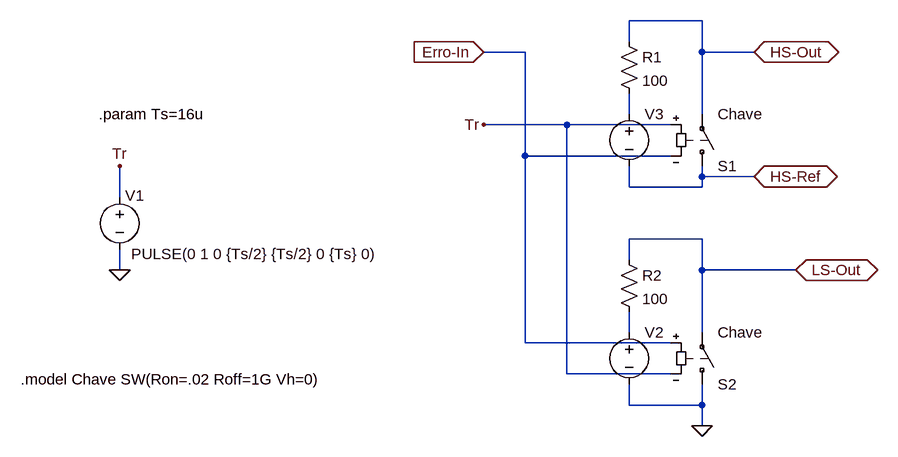
[diagram p0: schematic modulador_PWM_driver.asc]
modulador_PWM_driver.asc, the LTspice schematic file:
Version 4
SHEET 1 1388 680
WIRE 1104 -16 992 -16
WIRE 992 16 992 -16
WIRE 832 32 768 32
WIRE 1104 32 1104 -16
WIRE 1184 32 1104 32
WIRE 992 128 992 96
WIRE 1104 128 1104 32
WIRE 896 144 768 144
WIRE 1056 144 896 144
WIRE 832 192 832 32
WIRE 1056 192 832 192
WIRE 1104 224 1104 208
WIRE 1184 224 1104 224
WIRE 992 240 992 208
WIRE 1104 240 1104 224
WIRE 1104 240 992 240
WIRE 208 256 208 208
WIRE 1104 320 992 320
WIRE 992 352 992 320
WIRE 208 368 208 336
WIRE 1104 368 1104 320
WIRE 1248 368 1104 368
WIRE 992 464 992 432
WIRE 1104 464 1104 368
WIRE 832 480 832 192
WIRE 1056 480 832 480
WIRE 896 528 896 144
WIRE 1056 528 896 528
WIRE 992 576 992 544
WIRE 1104 576 1104 544
WIRE 1104 576 992 576
WIRE 1104 608 1104 576
FLAG 1184 32 HS-Out
IOPIN 1184 32 BiDir
FLAG 1248 368 LS-Out
IOPIN 1248 368 BiDir
FLAG 1184 224 HS-Ref
IOPIN 1184 224 BiDir
FLAG 768 32 Erro-In
IOPIN 768 32 In
FLAG 208 368 0
FLAG 208 208 Tr
FLAG 1104 608 0
FLAG 768 144 Tr
SYMBOL voltage 208 240 R0
WINDOW 3 18 103 Left 2
WINDOW 123 0 0 Left 2
WINDOW 0 9 13 Left 2
SYMATTR Value PULSE(0 1 0 {Ts/2} {Ts/2} 0 {Ts} 0)
SYMATTR InstName V1
SYMATTR SpiceLine Rser=0
SYMBOL sw 1104 560 M180
SYMATTR InstName S2
SYMATTR Value Chave
SYMBOL res 976 336 R0
SYMATTR InstName R2
SYMATTR Value 100
SYMBOL voltage 992 448 R0
WINDOW 3 24 96 Invisible 2
WINDOW 123 0 0 Left 2
SYMATTR Value 16
SYMATTR SpiceLine Rser=0
SYMATTR InstName V2
SYMBOL sw 1104 224 M180
SYMATTR InstName S1
SYMATTR Value Chave
SYMBOL res 976 0 R0
SYMATTR InstName R1
SYMATTR Value 100
SYMBOL voltage 992 112 R0
WINDOW 3 24 96 Invisible 2
WINDOW 123 0 0 Left 2
SYMATTR Value 16
SYMATTR SpiceLine Rser=0
SYMATTR InstName V3
TEXT 176 128 Left 2 !.param Ts=16u
TEXT 56 536 Left 2 !.model Chave SW(Ron=.02 Roff=1G Vh=0)

The netlist it stands for:
* modulador_PWM_driver.asc
V1 Tr 0 PULSE(0 1 0 {Ts/2} {Ts/2} 0 {Ts} 0) Rser=0
S2 0 LS-Out Erro-In Tr Chave
R2 LS-Out N002 100
V2 N002 0 16 Rser=0
S1 HS-Ref HS-Out Tr Erro-In Chave
R1 HS-Out N001 100
V3 N001 HS-Ref 16 Rser=0
.param Ts=16u
.model Chave SW(Ron=.02 Roff=1G Vh=0)
.backanno
.end